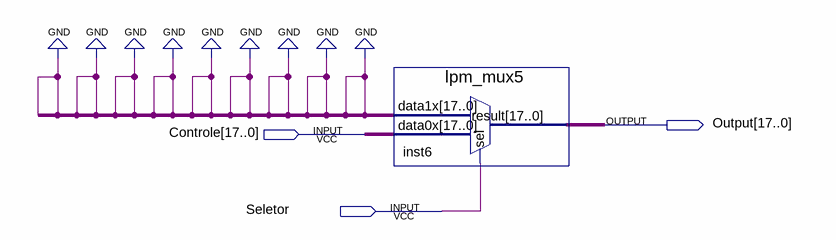
[diagram p0: schematic sheet]
// Quartus schematic testemux.bdf as structural Verilog: 1 symbols, 3 pins
module testemux (
  input  [17:0] Controle,
  input  Seletor,
  output [17:0] Output
);

  lpm_mux5 inst6 (.data1x({18{1'b0}}), .data0x(Controle), .sel(Seletor), .result(Output));
endmodule
